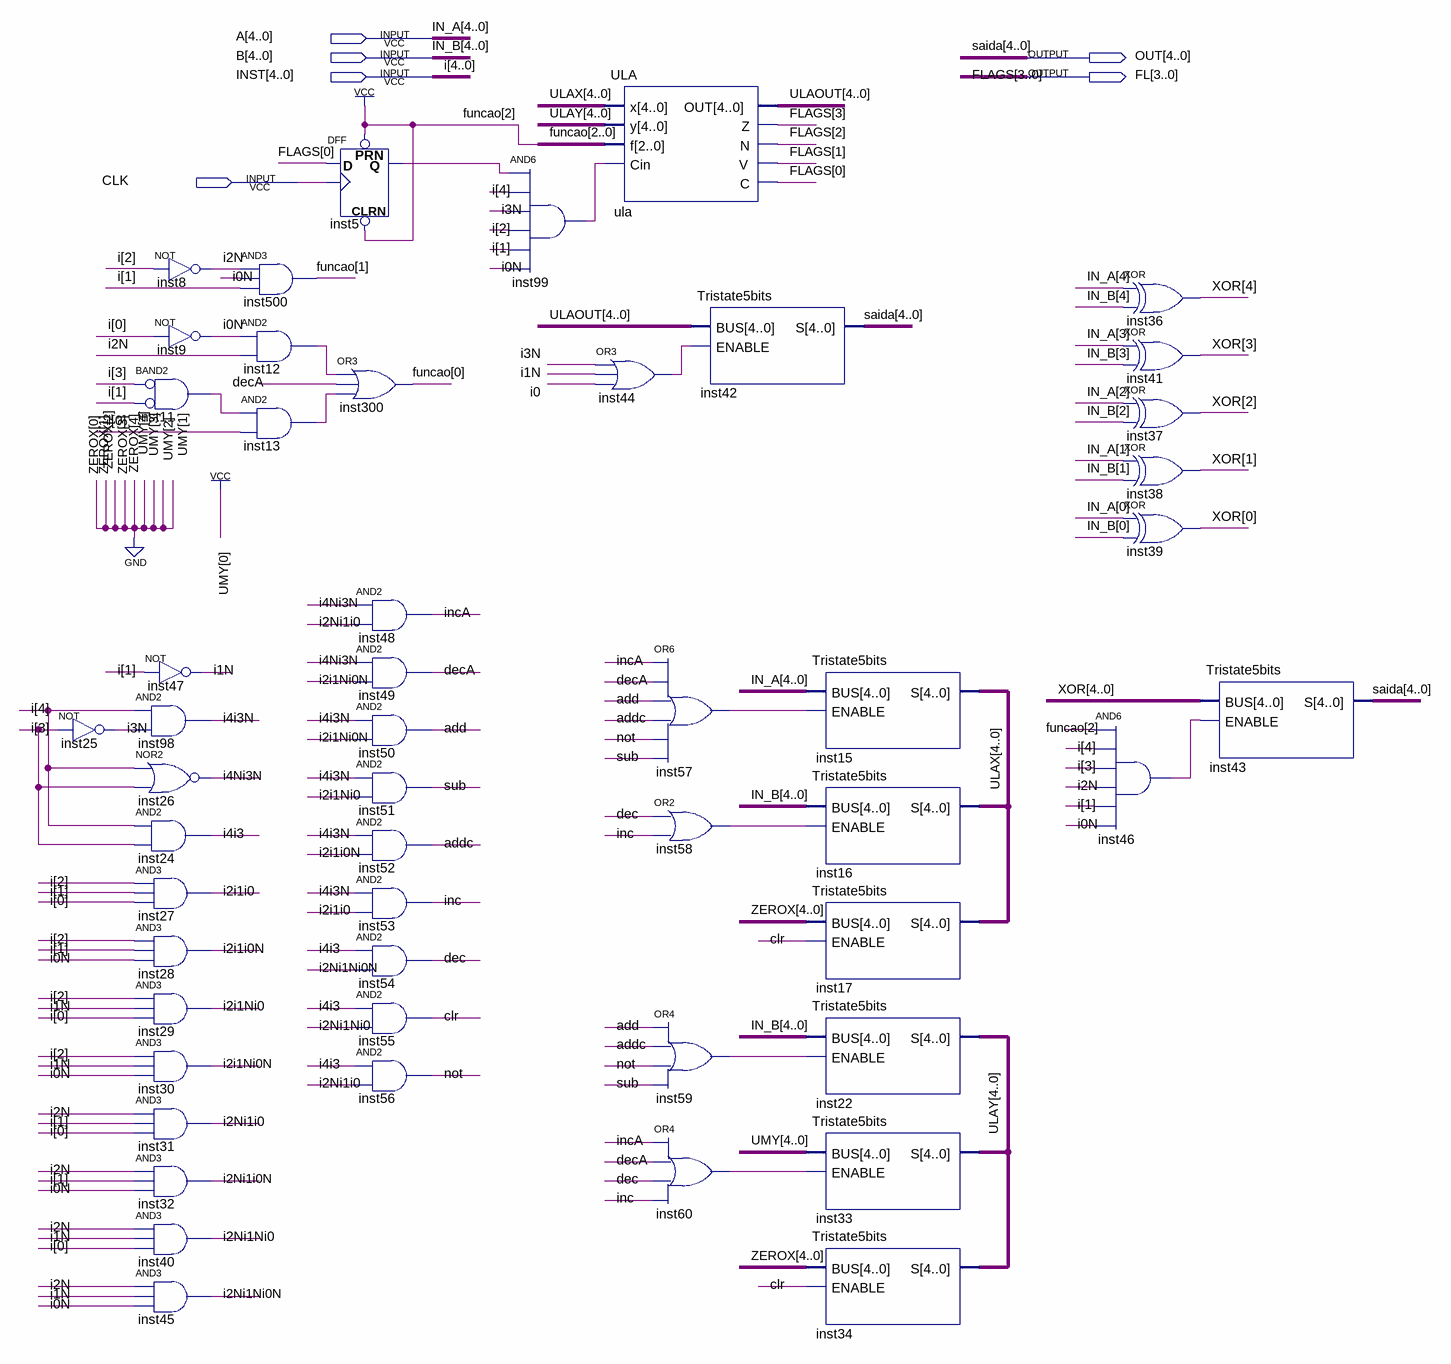
[diagram p0: schematic sheet]
// Quartus schematic BlocoLogArit.bdf as structural Verilog: 51 symbols, 6 pins
module BlocoLogArit (
  input  [4:0] A,
  input  [4:0] B,
  input  [4:0] INST,
  input  CLK,
  output [4:0] OUT,
  output [3:0] FL
);

  wire add, addc, clr, dec, decA, i0N, i1N, i2i1i0, i2i1i0N, i2i1Ni0, i2i1Ni0N, i2N, i2Ni1i0, i2Ni1i0N,
       i2Ni1Ni0, i2Ni1Ni0N, i3N, i4i3, i4i3N, i4Ni3N, inc, incA, inst5_q, inst11_out, inst12_out, inst13_out,
       inst44_out, inst46_out, inst57_out, inst58_out, inst59_out, inst60_out, inst99_out, \not , sub;
  wire [1:0] funcao;
  wire [4:0] ULAOUT, ULAX, ULAY, XOR;

  not inst25 (i3N, INST[3]);
  not inst8 (i2N, INST[2]);
  not inst9 (i0N, INST[0]);
  and inst11 (inst11_out, ~INST[3], ~INST[1]);  // BAND2
  not inst47 (i1N, INST[1]);
  and inst98 (i4i3N, INST[4], i3N);
  nor inst26 (i4Ni3N, INST[4], INST[3]);
  and inst24 (i4i3, INST[4], INST[3]);
  and inst27 (i2i1i0, INST[2], INST[1], INST[0]);
  and inst28 (i2i1i0N, INST[2], INST[1], i0N);
  and inst29 (i2i1Ni0, INST[2], i1N, INST[0]);
  and inst30 (i2i1Ni0N, INST[2], i1N, i0N);
  and inst31 (i2Ni1i0, i2N, INST[1], INST[0]);
  and inst32 (i2Ni1i0N, i2N, INST[1], i0N);
  and inst40 (i2Ni1Ni0, i2N, i1N, INST[0]);
  and inst45 (i2Ni1Ni0N, i2N, i1N, i0N);
  and inst500 (funcao[1], i2N, i0N, INST[1]);
  and inst12 (inst12_out, i0N, i2N);
  and inst13 (inst13_out, inst11_out, INST[0]);
  DFF inst5 (.CLRN(1'b1), .CLK(CLK), .D(FL[0]), .PRN(1'b1), .Q(inst5_q));
  or inst300 (funcao[0], inst12_out, decA, inst13_out);
  and inst48 (incA, i4Ni3N, i2Ni1i0);
  and inst49 (decA, i4Ni3N, i2i1Ni0N);
  and inst50 (add, i4i3N, i2i1Ni0N);
  and inst51 (sub, i4i3N, i2i1Ni0);
  and inst52 (addc, i4i3N, i2i1i0N);
  and inst53 (inc, i4i3N, i2i1i0);
  and inst54 (dec, i4i3, i2Ni1Ni0N);
  and inst55 (clr, i4i3, i2Ni1Ni0);
  and inst56 (\not , i4i3, i2Ni1i0);
  and inst99 (inst99_out, inst5_q, INST[4], i3N, INST[2], INST[1], i0N);
  ULA ula (
    .x(ULAX), .y(ULAY), .f({1'b1, funcao}), .Cin(inst99_out), .OUT(ULAOUT), .Z(FL[3]), .N(FL[2]), .V(FL[1]),
    .C(FL[0]));
  or inst44 (inst44_out, i3N, i1N, INST[0]);
  Tristate5bits inst42 (.BUS(ULAOUT), .ENABLE(inst44_out), .S(OUT));
  or inst57 (inst57_out, incA, decA, add, addc, \not , sub);
  or inst58 (inst58_out, dec, inc);
  or inst59 (inst59_out, add, addc, \not , sub);
  or inst60 (inst60_out, incA, decA, dec, inc);
  Tristate5bits inst15 (.BUS(A), .ENABLE(inst57_out), .S(ULAX));
  Tristate5bits inst16 (.BUS(B), .ENABLE(inst58_out), .S(ULAX));
  Tristate5bits inst17 (.BUS({5{1'b0}}), .ENABLE(clr), .S(ULAX));
  Tristate5bits inst22 (.BUS(B), .ENABLE(inst59_out), .S(ULAY));
  Tristate5bits inst33 (.BUS(5'b00001), .ENABLE(inst60_out), .S(ULAY));
  Tristate5bits inst34 (.BUS({5{1'b0}}), .ENABLE(clr), .S(ULAY));
  xor inst36 (XOR[4], A[4], B[4]);
  xor inst41 (XOR[3], A[3], B[3]);
  xor inst37 (XOR[2], A[2], B[2]);
  xor inst38 (XOR[1], A[1], B[1]);
  xor inst39 (XOR[0], A[0], B[0]);
  and inst46 (inst46_out, 1'b1, INST[4], INST[3], i2N, INST[1], i0N);
  Tristate5bits inst43 (.BUS(XOR), .ENABLE(inst46_out), .S(OUT));

  // Other names for the same wires on the sheet: FLAGS[3:0] = FL; i[4:0] = INST; i0 = INST[0]; IN_A[4:0] = A;
  //   IN_B[4:0] = B; saida[4:0] = OUT
endmodule
